# Altium project fan_control.PrjPcb
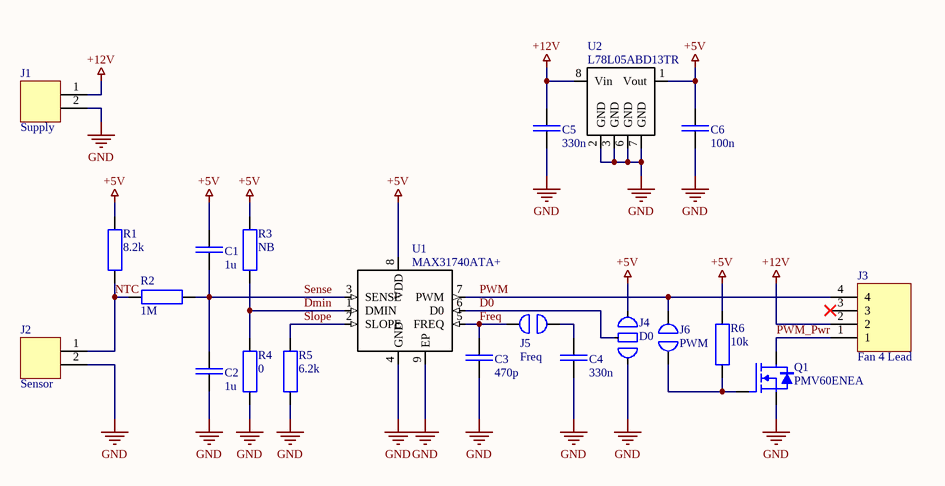
[diagram p0: fan_control.SchDoc]
1 sheet, 21 parts. Net scope: global (net labels, ports and power ports of the same name join across sheets).
Board file: fan_control.PcbDoc

## Sheet fan_control.SchDoc: Fan Control
size A4; DrawnBy: daniw; Revision: 1; SheetNumber: 1; SheetTotal: 1

### Parts
C1  1u  [C_0805_S]
C2  1u  [C_0805_S]
C3  470p  [C_0805_S]
C4  330n  [C_0805_S]
C5  330n  [C_0805_S]
C6  100n  [C_0805_S]
J1  Supply  [HEADER_2_RM_2.54]
J2  Sensor  [HEADER_2_RM_2.54]
J3  Fan 4 Lead  [CON_1x4_RM2.5_Molex_MINI_LATCH]
J4  D0  [Solder_Jumper_3pin_0.3mm]
J5  Freq  [Solder_Jumper_2pin_0.3mm]
J6  PWM  [Solder_Jumper_2pin_0.3mm]
Q1  PMV60ENEA  [SOT-23]
R1  8.2k  [R_0805_S]
R2  1M  [R_0805_S]
R3  NB  [R_0805_S]
R4  0  [R_0805_S]
R5  6.2k  [R_0805_S]
R6  10k  [R_0805_S]
U1  MAX31740ATA+  [TDFN-8 0.5mm]
U2  L78L05ABD13TR  [SOIC8]

### Nets
+5V: C1.1 C6.1 J4.1 R1.1 R3.2 R6.2 U1.8(VDD) U2.1(Vout)
+12V: C5.1 J1.1 J3.2 U2.8(Vin)
GND: C2.2 C3.2 C4.2 C5.2 C6.2 J1.2 J2.2 J4.3 Q1.S(SOURCE) R4.1 R5.1 U1.4(GND) U1.9(EP) U2.2(GND) U2.3(GND) U2.6(GND) U2.7(GND)
D0: J4.2 U1.6(D0)
Dmin: R3.1 R4.2 U1.1(DMIN)
Freq: C3.1 J5.1 U1.5(FREQ)
NTC: J2.1 R1.2 R2.1
PWM: J3.4 J6.2 U1.7(PWM)
PWM_Pwr: J3.1 Q1.D(DRAIN)
Sense: C1.2 C2.1 R2.2 U1.3(SENSE)
Slope: R5.2 U1.2(SLOPE)
NetC4_1: C4.1 J5.2
NetJ6_1: J6.1 Q1.G(GATE) R6.1

Not connected (* = marked no-connect by the designer): J3 3*

### Library data of the parts
C1-C6 = C
J1 J2 = CON2
J3 = CON4
J4 = SolderJumper_3
J5 J6 = SolderJumper_2
Q1 = MOSFET N: pin to pad: D>3 G>1 S>2
R1-R6 = R: Normaler Widerstand
U1 = MAX31740ATA+: Ultra-Simple Fan-Speed Controller
U2 = L78L05ABD13TR: Positive voltage regulator 5V, SO8